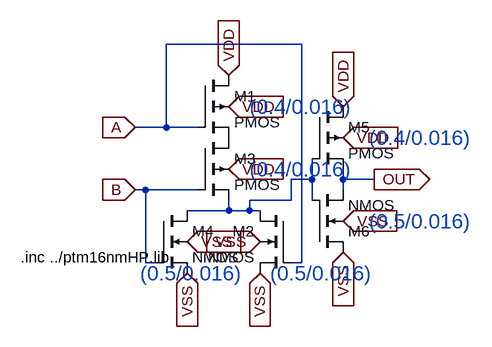
[diagram p0: schematic LOGIC_OR_cCMOS.asc]
LOGIC_OR_cCMOS.asc, the LTspice schematic file:
Version 4
SHEET 1 880 680
WIRE 240 -32 32 -32
WIRE 32 96 32 -32
WIRE 32 96 -16 96
WIRE 80 96 32 96
WIRE 256 176 256 144
WIRE 256 176 224 176
WIRE 304 176 304 160
WIRE 352 176 304 176
WIRE 0 192 -16 192
WIRE 80 192 0 192
WIRE 304 192 304 176
WIRE 224 208 224 176
WIRE 224 208 160 208
WIRE 256 208 256 176
WIRE 128 224 128 208
WIRE 128 224 64 224
WIRE 160 224 160 208
WIRE 160 224 128 224
WIRE 176 224 160 224
WIRE 0 304 0 192
WIRE 16 304 0 304
WIRE 240 304 240 -32
WIRE 240 304 224 304
FLAG 128 16 VDD
IOPIN 128 16 In
FLAG 128 64 VDD
IOPIN 128 64 In
FLAG 128 160 VDD
IOPIN 128 160 In
FLAG 176 272 VSS
IOPIN 176 272 In
FLAG 64 272 VSS
IOPIN 64 272 In
FLAG 64 320 VSS
IOPIN 64 320 In
FLAG 176 320 VSS
IOPIN 176 320 In
FLAG -16 96 A
IOPIN -16 96 In
FLAG -16 192 B
IOPIN -16 192 In
FLAG 352 176 OUT
IOPIN 352 176 Out
FLAG 304 64 VDD
IOPIN 304 64 In
FLAG 304 112 VDD
IOPIN 304 112 In
FLAG 304 240 VSS
IOPIN 304 240 In
FLAG 304 288 VSS
IOPIN 304 288 In
SYMBOL pmos4 80 16 R0
SYMATTR InstName M1
SYMATTR Value2 l=16n w=400n
SYMBOL nmos4 224 224 M0
SYMATTR InstName M2
SYMATTR Value2 l=16n w=500n
SYMBOL pmos4 80 112 R0
SYMATTR InstName M3
SYMATTR Value2 l=16n w=400n
SYMBOL nmos4 16 224 R0
SYMATTR InstName M4
SYMATTR Value2 l=16n w=500n
SYMBOL pmos4 256 64 R0
SYMATTR InstName M5
SYMATTR Value2 l=16n w=400n
SYMBOL nmos4 256 288 M180
SYMATTR InstName M6
SYMATTR Value2 l=16n w=500n
TEXT -192 296 Left 2 !.inc ../ptm16nmHP.lib
TEXT 160 64 Left 3 ;(0.4/0.016)
TEXT 160 160 Left 3 ;(0.4/0.016)
TEXT 344 112 Left 3 ;(0.4/0.016)
TEXT 344 240 Left 3 ;(0.5/0.016)
TEXT -8 320 Left 3 ;(0.5/0.016)
TEXT 192 320 Left 3 ;(0.5/0.016)

The netlist it stands for:
* LOGIC_OR_cCMOS.asc
M1 VDD A P001 VDD PMOS l=16n w=400n
M2 N001 A VSS VSS NMOS l=16n w=500n
M3 P001 B N001 VDD PMOS l=16n w=400n
M4 N001 B VSS VSS NMOS l=16n w=500n
M5 VDD N001 OUT VDD PMOS l=16n w=400n
M6 VSS N001 OUT VSS NMOS l=16n w=500n
.model NMOS NMOS
.model PMOS PMOS
.lib standard.mos
.inc ../ptm16nmHP.lib
* (0.4/0.016)
* (0.4/0.016)
* (0.4/0.016)
* (0.5/0.016)
* (0.5/0.016)
* (0.5/0.016)
.backanno
.end